# Altium schematic sheet Microcontroller.SchDoc
size A3; SheetNumber: 4; SheetTotal: 5
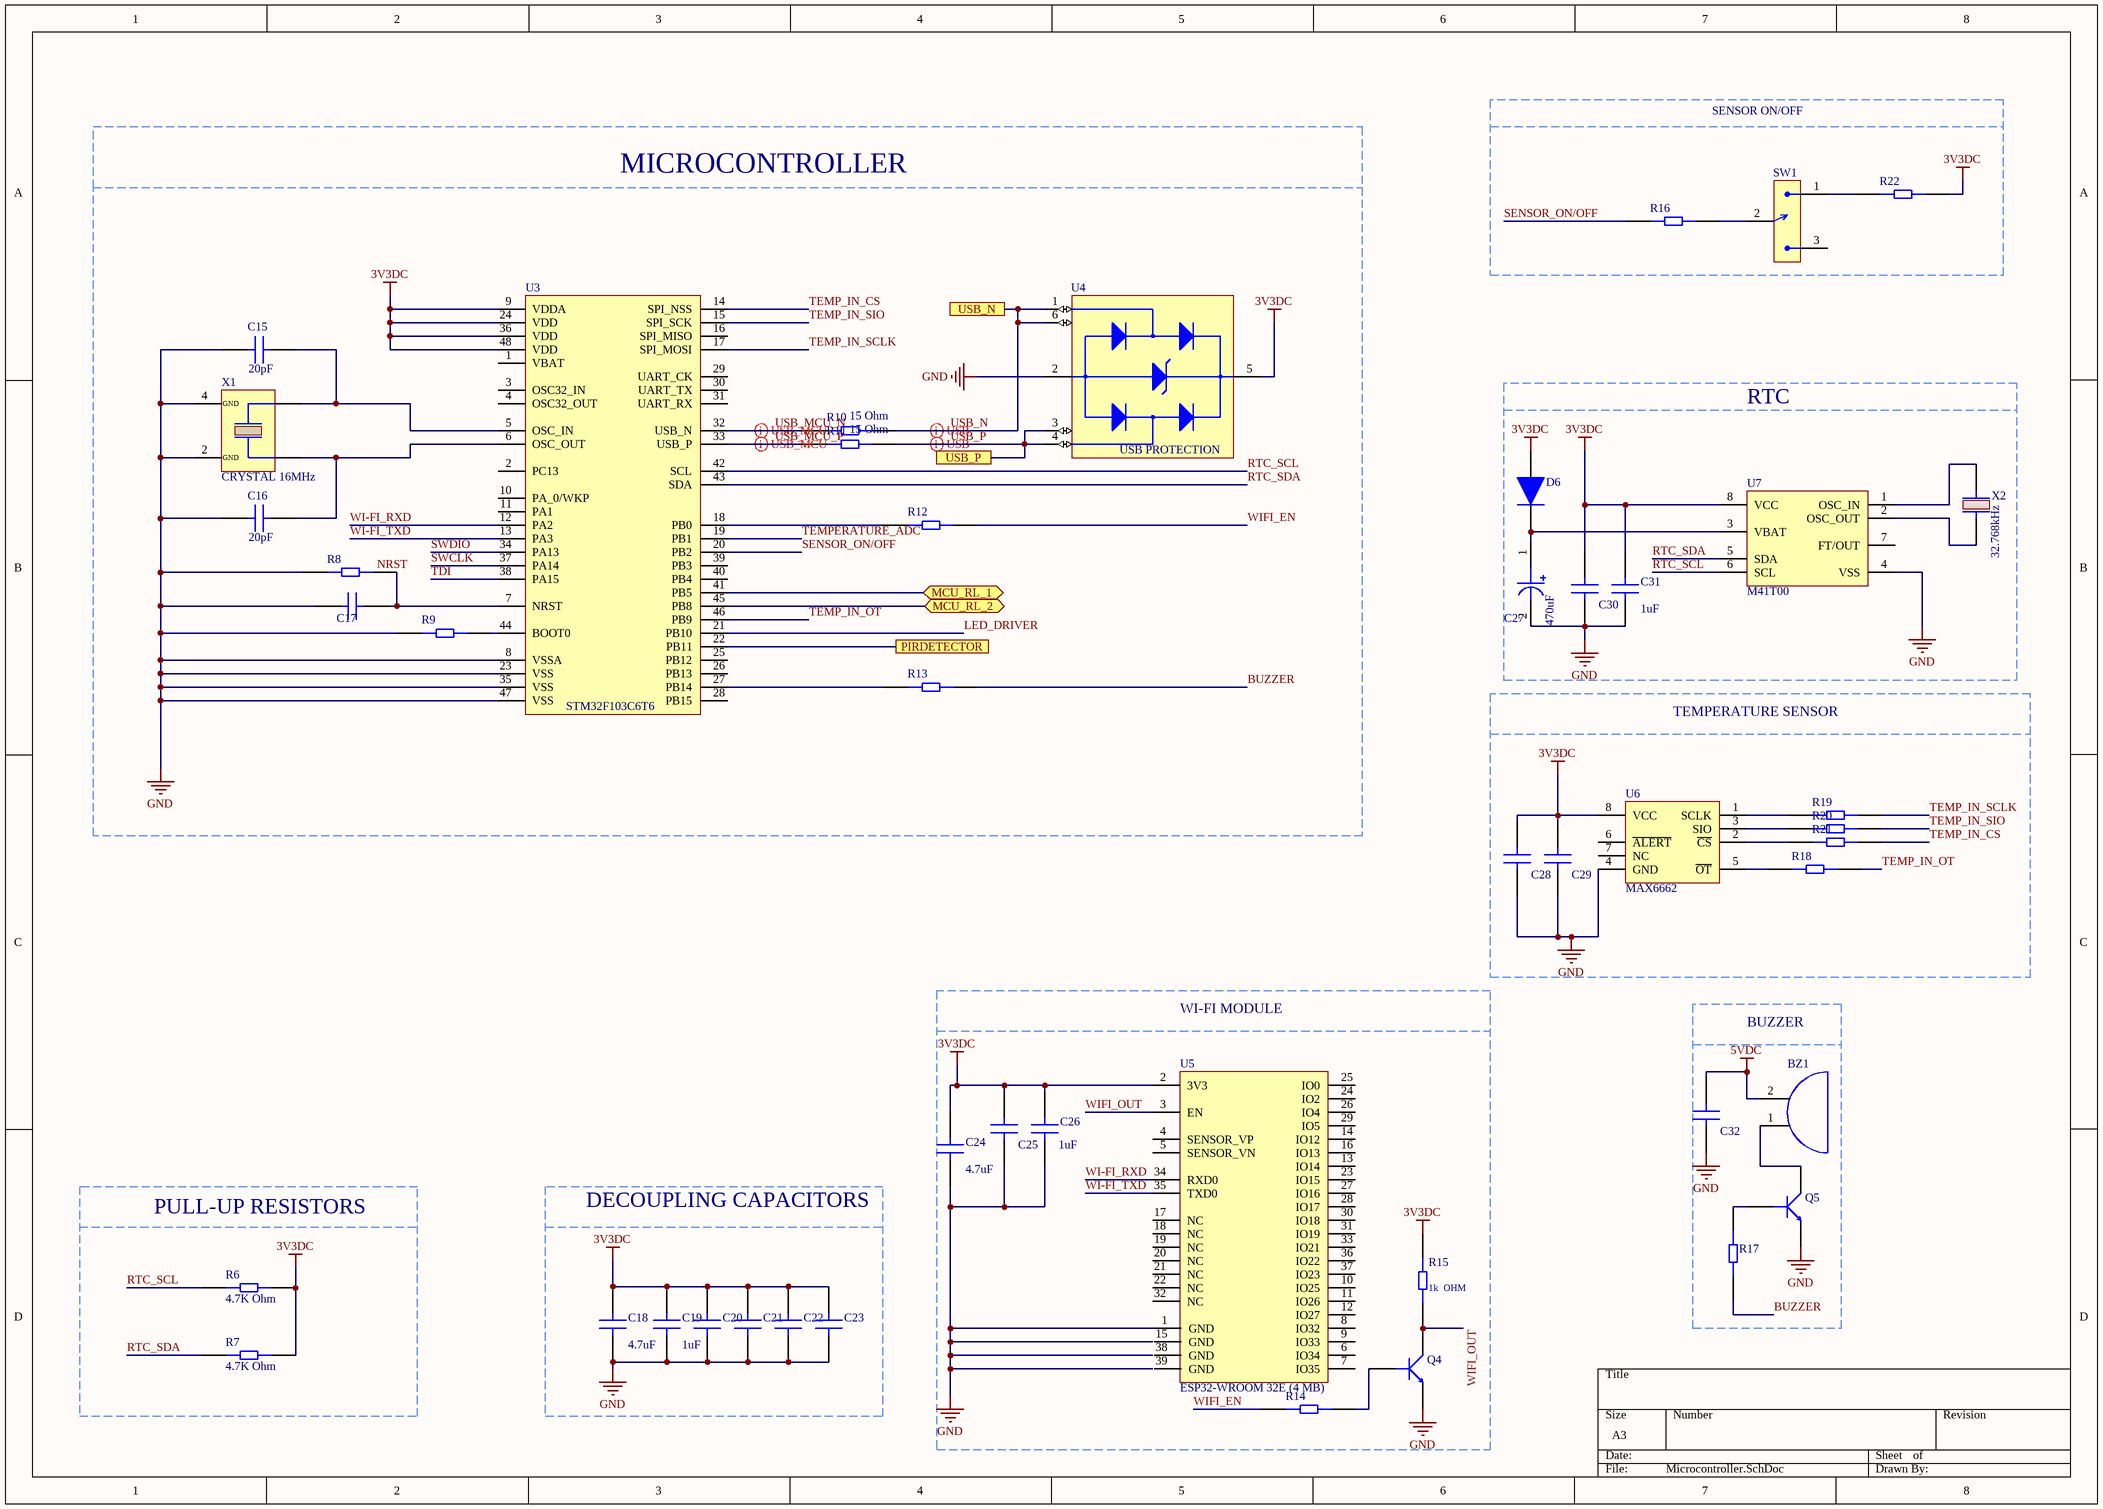
[diagram p0: Microcontroller.SchDoc]

## Parts
BZ1  CMI-9605IC-0580T  [CMI-9605IC]  (value not drawn)
C15  Cap: 20pF  [CAP_0603]  (hidden comment: CAP CER 20pF 0603)
C16  Cap: 20pF  [CAP_0603]  (hidden comment: CAP CER 20pF 0603)
C17  CAP CER 100nF 0603  [CAP_0603]  (value not drawn)
C18  Cap: 4.7uF  [CAP 0805]  (hidden comment: CAP CER 4.7uF 0805)
C19  Cap: 1uF  [CAP 0805]  (hidden comment: CAP CER 1uF)
C20  CAP CER 100nF 0603  [CAP_0603]  (value not drawn)
C21  CAP CER 100nF 0603  [CAP_0603]  (value not drawn)
C22  CAP CER 100nF 0603  [CAP_0603]  (value not drawn)
C23  CAP CER 100nF 0603  [CAP_0603]  (value not drawn)
C24  Cap: 4.7uF  [CAP 0805]  (hidden comment: CAP CER 4.7uF 0805)
C25  CAP CER 100nF 0603  [CAP_0603]  (value not drawn)
C26  Cap: 1uF  [CAP 0805]  (hidden comment: CAP CER 1uF)
C27  Cap: 470uF  [CAP_RADIAL_D10_P5]  (hidden comment: ESH477M050AH4AA)
C28  CAP CER 100nF 0603  [CAP_0603]  (value not drawn)
C29  CAP CER 100nF 0603  [CAP_0603]  (value not drawn)
C30  CAP CER 100nF 0603  [CAP_0603]  (value not drawn)
C31  Cap: 1uF  [CAP 0805]  (hidden comment: CAP CER 1uF)
C32  CAP CER 100nF 0603  [CAP_0603]  (value not drawn)
D6  1N4148WS  [SOD323F]  (value not drawn)
Q4  MMBT3904-7-F  [SOT-23F]  (value not drawn)
Q5  MMBT3904-7-F  [SOT-23F]  (value not drawn)
R6  Resistance: 4.7K Ohm  [RES_0603]  (hidden comment: RES 4.7K OHM 0603)
R7  Resistance: 4.7K Ohm  [RES_0603]  (hidden comment: RES 4.7K OHM 0603)
R8  RES 100 OHM 0603  [RES_0603]  (value not drawn)
R9  RES 100 OHM 0603  [RES_0603]  (value not drawn)
R10  Resistance: 15 Ohm  (hidden comment: RES 15 OHM 0603)
R11  Resistance: 15 Ohm  (hidden comment: RES 15 OHM 0603)
R12  RES 100 OHM 0603  [RES_0603]  (value not drawn)
R13  RES 100 OHM 0603  [RES_0603]  (value not drawn)
R14  RES 100 OHM 0603  [RES_0603]  (value not drawn)
R15  Reisitance: 1k  OHM  [RES_0603]  (hidden comment: RES 1K OHM 0603)
R16  RES 100 OHM 0603  [RES_0603]  (value not drawn)
R17  RES 100 OHM 0603  [RES_0603]  (value not drawn)
R18  RES 100 OHM 0603  [RES_0603]  (value not drawn)
R19  RES 100 OHM 0603  [RES_0603]  (value not drawn)
R20  RES 100 OHM 0603  [RES_0603]  (value not drawn)
R21  RES 100 OHM 0603  [RES_0603]  (value not drawn)
R22  RES 100 OHM 0603  [RES_0603]  (value not drawn)
SW1  EG1215AA  [EG121]  (value not drawn)
U3  STM32F103C6T6  [LQFP-48]
U4  USB PROTECTION  [SOT23-6L]
U5  ESP32-WROOM 32E (4 MB)  [ESP32-32E]
U6  MAX6662  [SOIC8]
U7  M41T00  [SOIC8]
X1  CRYSTAL 16MHz  [ECS]
X2  FREQ: 32.768kHz  [AB505]  (hidden comment: CRYSTAL 32768kHZ)

## Blocks framed on the sheet
SENSOR ON/OFF: R16 R22 SW1
MICROCONTROLLER: C15-C17 R8-R13 U3 U4 X1
RTC: C27 C30 C31 D6 U7 X2
TEMPERATURE SENSOR: C28 C29 R18-R21 U6
WI-FI MODULE: C24-C26 Q4 R14 R15 U5
BUZZER: BZ1 C32 Q5 R17

## Ports
MCU_RL_1 (bidir, see Power Management[288,178]), MCU_RL_2 (bidir, see Power Management[339.076,49.022]), PIRDETECTOR (see Power Management[234.442,99.822]), USB_N (see Power Management[176.84,54]), USB_P (see Power Management[176.784,50.8])

## Nets
3V3DC: C18.2 C19.2 C20.2 C21.2 C22.2 C23.2 C24.2 C25.2 C26.1 C28.2 C29.2 C30.2 C31.1 D6.2 R6.2 R7.2 R15.2 R22.2 U3.9(VDDA) U3.24(VDD) U3.36(VDD) U3.48(VDD) U4.5(VBUS) U5.2(3V3) U6.8(VCC) U7.8(VCC)
5VDC: BZ1.2 C32.2
GND: C15.2 C16.2 C17.2 C18.1 C19.1 C20.1 C21.1 C22.1 C23.1 C24.1 C25.1 C26.2 C27.2 C28.1 C29.1 C30.1 C31.2 C32.1 Q4.2(E) Q5.2(E) R8.1 R9.1 U3.8(VSSA) U3.23(VSS) U3.35(VSS) U3.47(VSS) U4.2(GND) U5.1(GND) U6.4(GND) U7.4(VSS) X1.2(GND) X1.4(GND)
BUZZER: R13.2 R17.1
LED_DRIVER: U3.21(PB10)
MCU_RL_1: U3.41(PB5) ; port MCU_RL_1
MCU_RL_2: U3.45(PB8) ; port MCU_RL_2
PIRDETECTOR: U3.22(PB11) ; port PIRDETECTOR
RTC_SCL: R6.1 U3.42(SCL) U7.6(SCL)
RTC_SDA: R7.1 U3.43(SDA) U7.5(SDA)
SENSOR_ON/OFF: R16.1 U3.20(PB2)
SWCLK: U3.37(PA14)
SWDIO: U3.34(PA13)
TDI: U3.38(PA15)
TEMP_IN_CS: R21.2 U3.14(SPI_NSS)
TEMP_IN_OT: R18.2 U3.46(PB9)
TEMP_IN_SCLK: R19.2 U3.17(SPI_MOSI)
TEMP_IN_SIO: R20.2 U3.15(SPI_SCK)
TEMPERATURE_ADC: U3.19(PB1)
USB_MCU_N: R10.1 U3.32(USB_N)
USB_MCU_P: R11.1 U3.33(USB_P)
USB_N: R10.2 U4.1(I/O1) U4.6(I/O1) ; port USB_N
USB_P: R11.2 U4.3(I/O2) U4.4(I/O2) ; port USB_P
WI-FI_RXD: U3.12(PA2) U5.34(RXD0)
WI-FI_TXD: U3.13(PA3) U5.35(TXD0)
WIFI_EN: R12.2 R14.1
WIFI_OUT: Q4.3(C) R15.1 U5.3(EN)
NetBZ1_1: BZ1.1 Q5.3(C)
NetC15_1: C15.1 U3.5(OSC_IN) X1.3
NetC16_1: C16.1 U3.6(OSC_OUT) X1.1
NetC17_1: C17.1 R8.2 U3.7(NRST)
NetC27_1: C27.1 D6.1 U7.3(VBAT)
NetQ4_1: Q4.1(B) R14.2
NetQ5_1: Q5.1(B) R17.2
NetR9_2: R9.2 U3.44(BOOT0)
NetR12_1: R12.1 U3.18(PB0)
NetR13_1: R13.1 U3.27(PB14)
NetR16_2: R16.2 SW1.2
NetR18_1: R18.1 U6.5(~{OT})
NetR19_1: R19.1 U6.1(SCLK)
NetR20_1: R20.1 U6.3(SIO)
NetR21_1: R21.1 U6.2(~{CS})
NetR22_1: R22.1 SW1.1
NetU7_1: U7.1(OSC_IN) X2.2
NetU7_2: U7.2(OSC_OUT) X2.1

Not connected (* = marked no-connect by the designer): SW1 3; U3 1(VBAT) 2(PC13) 3(OSC32_IN) 4(OSC32_OUT) 10(PA_0/WKP) 11(PA1) 16(SPI_MISO) 25(PB12) 26(PB13) 28(PB15) 29(UART_CK) 30(UART_TX) 31(UART_RX) 39(PB3) 40(PB4); U5 4(SENSOR_VP) 5(SENSOR_VN) 6(IO34) 7(IO35) 8(IO32) 9(IO33) 10(IO25) 11(IO26) 12(IO27) 13(IO14) 14(IO12) 15(GND) 16(IO13) 17(NC) 18(NC) 19(NC) 20(NC) 21(NC) 22(NC) 23(IO15) 24(IO2) 25(IO0) 26(IO4) 27(IO16) 28(IO17) 29(IO5) 30(IO18) 31(IO19) 32(NC) 33(IO21) 36(IO22) 37(IO23) 38(GND) 39(GND); U6 6(~{ALERT}) 7(NC); U7 7(FT/OUT)

## Layout directives
differential pair: USB_MCU_N, USB_MCU_P, USB_N, USB_P

## Notes on the sheet
- PULL-UP RESISTORS
- DECOUPLING CAPACITORS
- Labels drawn without touching a wire or pin: NRST

## Library data of the parts
BZ1 = CMI-9605IC-0580T: Audio Buzzer Magnetic 3VDC 7VDC 30mA 5VDC 85dB 2600Hz to 2800Hz Through Hole Pin Box; Manufacturer: CUI Devices; Supplier 1: Arrow Electronics; Manufacturer Part Number: CMI-9605IC-0580T; RoHS: No; Category: Audio Products; Stock 1: 1; Pricing 1: 1=1.3577, 10=1.146, 25=1.0571, 50=0.9935, 100=0.9263, 300=0.797, 600=0.7855 (USD); Supplier 2: Arrow Electronics; Stock 2: 1; Pricing 2: 1=1.3577, 10=1.146, 25=1.0571, 50=0.9935, 100=0.9263, 300=0.797, 600=0.7855 (USD); Supplier Part Number 2: CMI-9605IC-0580T; Case/Package: CMI-9605IC
C18 C24 = CAP CER 4.7uF 0805: CAP CER 4.7UF 25V X5R 0805; Manufacturer: Samsung; Manufacturer Part Number: CL21A475KAQNNNE; Supplier 1: Arrow Electronics; RoHS: Yes; Category: Ceramic Capacitors; Stock 1: 906000; Pricing 1: 2000=0.0173, 4000=0.0169, 10000=0.0146, 14000=0.0133, 50000=0.0114, 100000=0.0096, 200000=0.0089 (USD); ComponentLink1URL: https://datasheet.ciiva.com/25798/cl21a475kaqnnne-25798882.pdf?src-supplier=Digi-Key; ComponentLink1Description: https://datasheet.ciiva.com/25798/cl21a475kaqnnne-25798882.pdf?src-supplier=Digi-Key; Supplier Part Number 1: CL21A475KAQNNNE
C27 = ESH477M050AH4AA: Cap, 470UF, 50V, Alu Elec, Radial; Manufacturer: KEMET; Supplier 1: Mouser; Manufacturer Part Number: ESH477M050AH4AA; RoHS: Yes; Stock 1: 3823; Pricing 1: 1=0.57, 10=0.4, 50=0.302, 100=0.263, 1000=0.263, 10000=0.263 (USD); ComponentLink1URL: https://api.kemet.com/component-edge/download/datasheet/ESH477M050AH4AA.pdf?src-supplier=Digi-Key; ComponentLink1Description: https://api.kemet.com/component-edge/download/datasheet/ESH477M050AH4AA.pdf?src-supplier=Digi-Key; ComponentLink2URL: https://datasheet.octopart.com/ESH477M050AH4AA-KEMET-datasheet-130075338.pdf?src-supplier=Newark; ComponentLink2Description: https://datasheet.octopart.com/ESH477M050AH4AA-KEMET-datasheet-130075338.pdf?src-supplier=Newark; Supplier Part Number 1: 80-ESH477M050AH4AA
D6 = 1N4148WS: VR=75V IF=150mA Trr=4ns P=200mW; Manufacturer: ON Semiconductor / Fairchild; Supplier 1: Future Electronics; Manufacturer Part Number: 1N4148WS; RoHS: Yes; Category: Rectifier Diodes; Stock 1: 423000; Pricing 1: 3000=0.0191, 12000=0.0183, 45000=0.0175, 75000=0.0173, 150000=0.0164 (USD); ComponentLink1URL: https://datasheet.ciiva.com/30479/0900766b810e1cd3-30479206.pdf?src-supplier=Rs; ComponentLink1Description: https://datasheet.ciiva.com/30479/0900766b810e1cd3-30479206.pdf?src-supplier=Rs; ComponentLink2URL: https://datasheet.ciiva.com/8300/1n914bws-8300360.pdf?src-supplier=Avnet; ComponentLink2Description: https://datasheet.ciiva.com/8300/1n914bws-8300360.pdf?src-supplier=Avnet; ComponentLink3URL: https://datasheet.ciiva.com/15208/getdatasheetpartid-127819-15208358.pdf?src-supplier=Verical; ComponentLink3Description: https://datasheet.ciiva.com/15208/getdatasheetpartid-127819-15208358.pdf?src-supplier=Verical; ComponentLink4URL: https://datasheet.ciiva.com/910/1n4148ws-910380.pdf?src-supplier=Digi-Key; ComponentLink4Description: https://datasheet.ciiva.com/910/1n4148ws-910380.pdf?src-supplier=Digi-Key; ComponentLink5URL: https://datasheet.ciiva.com/910/1n4148ws-910381.pdf?src-supplier=Digi-Key; ComponentLink5Description: https://datasheet.ciiva.com/910/1n4148ws-910381.pdf?src-supplier=Digi-Key; ComponentLink6URL: https://datasheet.ciiva.com/910/1n4148ws-910382.pdf?src-supplier=Digi-Key; ComponentLink6Description: https://datasheet.ciiva.com/910/1n4148ws-910382.pdf?src-supplier=Digi-Key; Supplier Part Number 1: 8814485
SW1 = EG1215AA: Slide Switch, SPDT, 0.025A, 24V, SMD; Manufacturer: E-Switch; Mechanical Life: 10000Cycles; Switch Function: On-On; Actuator Type: Standard; Switch Travel: 1.5mm; Operating Force: 150gf; Actuator Length: 1.4mm; Supplier 1: Farnell; Manufacturer Part Number: EG1215AA; RoHS: Yes; Stock 1: 2239; Pricing 1: 1=1.06, 10=0.958, 25=0.831, 50=0.777, 100=0.722 (EUR); Mount: Surface Mount; Min Operating Temperature: -20°C; Max Operating Temperature: 70°C; Throw Configuration: SPDT; Packaging: Cut Tape; Voltage Rating (DC): 24V; Termination: Gull Wing; Electrical Life: 10000Cycles; Series: EG; RoHS Compliant: Yes; ComponentLink1URL: https://media.digikey.com/pdf/Data%20Sheets/E-Switch%20PDFs/EG1215_Series_Ds.pdf?src-supplier=Digi-Key; ComponentLink1Description: https://media.digikey.com/pdf/Data%20Sheets/E-Switch%20PDFs/EG1215_Series_Ds.pdf?src-supplier=Digi-Key; ComponentLink2URL: http://www.farnell.com/datasheets/2645007.pdf?src-supplier=Farnell; ComponentLink2Description: http://www.farnell.com/datasheets/2645007.pdf?src-supplier=Farnell; Supplier Part Number 1: 4050996
U4 = USB PROTECTION: TVS DIODE 5.25VWM 17VC SOT23-6; Manufacturer: STMicroelectronics; Manufacturer Part Number: USBLC6-2SC6; Supplier 1: Mouser; RoHS: Yes; Category: TVS Diodes; Stock 1: 229222; Pricing 1: 1=0.59, 10=0.507, 50=0.507, 100=0.379, 1000=0.23, 10000=0.182 (USD); ComponentLink1URL: https://datasheet.ciiva.com/15143/getdatasheetpartid-148465-15143789.pdf?src-supplier=Verical; ComponentLink1Description: https://datasheet.ciiva.com/15143/getdatasheetpartid-148465-15143789.pdf?src-supplier=Verical; ComponentLink2URL: https://datasheet.ciiva.com/4508/cd00050750-113117-4508433.pdf?src-supplier=Mouser; ComponentLink2Description: https://datasheet.ciiva.com/4508/cd00050750-113117-4508433.pdf?src-supplier=Mouser; ComponentLink3URL: https://datasheet.ciiva.com/1268/1690354-1268384.pdf?src-supplier=Element14; ComponentLink3Description: https://datasheet.ciiva.com/1268/1690354-1268384.pdf?src-supplier=Element14; ComponentLink4URL: https://datasheet.ciiva.com/16200/cd00050750-16200026.pdf?src-supplier=Future+Electronics; ComponentLink4Description: https://datasheet.ciiva.com/16200/cd00050750-16200026.pdf?src-supplier=Future+Electronics; ComponentLink5URL: https://datasheet.ciiva.com/41444/001184109-da-01-en-ic-esd-protecti-usblc6-2sc6-sot-23-6-stm-41444156.pdf?src-supplier=Conrad; ComponentLink5Description: https://datasheet.ciiva.com/41444/001184109-da-01-en-ic-esd-protecti-usblc6-2sc6-sot-23-6-stm-41444156.pdf?src-supplier=Conrad; Supplier Part Number 1: 511-USBLC6-2SC6
U6 = MAX6662: Temp Sensor Digital Serial (3-Wire, SPI) 8-Pin SOIC N Tube; Manufacturer: Maxim; Manufacturer Part Number: MAX6662MSA+; Supplier 1: Mouser; RoHS: Yes; Category: Temperature and Humidity Sensors; Stock 1: 1124; Pricing 1: 1=2.45, 10=2.35, 50=2.35, 100=2.34, 1000=2.2, 10000=1.95 (USD); ComponentLink1URL: https://datasheet.ciiva.com/5299/max6662-89142-5299456.pdf?src-supplier=Mouser; ComponentLink1Description: https://datasheet.ciiva.com/5299/max6662-89142-5299456.pdf?src-supplier=Mouser; ComponentLink2URL: https://datasheet.ciiva.com/3277/max6662-3277979.pdf?src-supplier=Avnet; ComponentLink2Description: https://datasheet.ciiva.com/3277/max6662-3277979.pdf?src-supplier=Avnet; ComponentLink3URL: https://datasheet.ciiva.com/2003/max6662-2003390.pdf?src-supplier=Digi-Key; ComponentLink3Description: https://datasheet.ciiva.com/2003/max6662-2003390.pdf?src-supplier=Digi-Key; Supplier Part Number 1: 700-MAX6662MSA
U7 = M41T00: Real-time Clocks Clock/Calendar I2C, 2-Wire Serial 70uA @ 2V ~ 5.5V SOIC-8_150mil RoHS; Manufacturer: STMicroelectronics; Manufacturer Part Number: M41T00M6F; Supplier 1: Digi-Key; RoHS: Yes; Category: Real Time Clocks; Stock 1: 5505; Pricing 1: 1=3.96, 10=3.556, 25=3.3616, 100=2.9134, 250=2.76404, 500=2.48016, 1000=2.11425 (USD); ComponentLink1URL: https://datasheet.ciiva.com/7630/1837112-7630077.pdf?src-supplier=Element14; ComponentLink1Description: https://datasheet.ciiva.com/7630/1837112-7630077.pdf?src-supplier=Element14; ComponentLink2URL: https://datasheet.ciiva.com/16213/cd00001542-16213654.pdf?src-supplier=Future+Electronics; ComponentLink2Description: https://datasheet.ciiva.com/16213/cd00001542-16213654.pdf?src-supplier=Future+Electronics; ComponentLink3URL: https://datasheet.ciiva.com/41459/001185345-da-01-en-ic-rtc-srl-512kbit-m41t00m6f-soic-8-stm-41459818.pdf?src-supplier=Conrad; ComponentLink3Description: https://datasheet.ciiva.com/41459/001185345-da-01-en-ic-rtc-srl-512kbit-m41t00m6f-soic-8-stm-41459818.pdf?src-supplier=Conrad; Supplier Part Number 1: 497-4697-1-ND
X1 = CRYSTAL 16MHz: Crystal 16MHz ±30ppm (Tol) ±50ppm (Stability) 20pF FUND 50Ohm 4-Pin Mini-SMD T/R; Manufacturer: Abracon; Manufacturer Part Number: ABS05-32.768KHZ-T; Supplier 1: Future Electronics; RoHS: Yes; Category: Crystals; Stock 1: 2890; Pricing 1: 1=0.85, 15=0.75, 75=0.69, 300=0.64, 1500=0.58 (USD); ComponentLink1URL: https://datasheet.ciiva.com/23810/abs05-23810480.pdf?src-supplier=Newark; ComponentLink1Description: https://datasheet.ciiva.com/23810/abs05-23810480.pdf?src-supplier=Newark; ComponentLink2URL: https://datasheet.ciiva.com/6728/abs05-6728949.pdf?src-supplier=Digi-Key; ComponentLink2Description: https://datasheet.ciiva.com/6728/abs05-6728949.pdf?src-supplier=Digi-Key; ComponentLink3URL: https://datasheet.ciiva.com/6728/abs05-6728950.pdf?src-supplier=Digi-Key; ComponentLink3Description: https://datasheet.ciiva.com/6728/abs05-6728950.pdf?src-supplier=Digi-Key; ComponentLink4URL: https://datasheet.ciiva.com/16411/abs05-16411149.pdf?src-supplier=Future+Electronics; ComponentLink4Description: https://datasheet.ciiva.com/16411/abs05-16411149.pdf?src-supplier=Future+Electronics; Supplier Part Number 1: 4097386; Supplier 2: Arrow Electronics; Stock 2: 17; Pricing 2: 1=0.8053, 10=0.7919 (USD); ComponentLink5URL: https://datasheet.ciiva.com/853/ecx-53b-853408.pdf?src-supplier=Digi-Key; ComponentLink5Description: https://datasheet.ciiva.com/853/ecx-53b-853408.pdf?src-supplier=Digi-Key; ComponentLink6URL: https://datasheet.ciiva.com/853/ecx-53b-853407.pdf?src-supplier=Digi-Key; ComponentLink6Description: https://datasheet.ciiva.com/853/ecx-53b-853407.pdf?src-supplier=Digi-Key; ComponentLink7URL: https://datasheet.ciiva.com/853/ecx-53b-853406.pdf?src-supplier=Digi-Key; ComponentLink7Description: https://datasheet.ciiva.com/853/ecx-53b-853406.pdf?src-supplier=Digi-Key; Supplier Part Number 2: ECS-160-20-30B-TR
X2 = CRYSTAL 32768kHZ: Crystal 0.032768MHz ±20ppm (Tol) 12.5pF Flexural 90000Ohm 2-Pin CSMD T/R; Manufacturer: Abracon; Manufacturer Part Number: ABS05-32.768KHZ-T; Supplier 1: Future Electronics; RoHS: Yes; Category: Crystals; Stock 1: 2890; Pricing 1: 1=0.85, 15=0.75, 75=0.69, 300=0.64, 1500=0.58 (USD); ComponentLink1URL: https://datasheet.ciiva.com/23810/abs05-23810480.pdf?src-supplier=Newark; ComponentLink1Description: https://datasheet.ciiva.com/23810/abs05-23810480.pdf?src-supplier=Newark; ComponentLink2URL: https://datasheet.ciiva.com/6728/abs05-6728949.pdf?src-supplier=Digi-Key; ComponentLink2Description: https://datasheet.ciiva.com/6728/abs05-6728949.pdf?src-supplier=Digi-Key; ComponentLink3URL: https://datasheet.ciiva.com/6728/abs05-6728950.pdf?src-supplier=Digi-Key; ComponentLink3Description: https://datasheet.ciiva.com/6728/abs05-6728950.pdf?src-supplier=Digi-Key; ComponentLink4URL: https://datasheet.ciiva.com/16411/abs05-16411149.pdf?src-supplier=Future+Electronics; ComponentLink4Description: https://datasheet.ciiva.com/16411/abs05-16411149.pdf?src-supplier=Future+Electronics; Supplier Part Number 1: 4097386
C17 C20-C23 C25 C28-C30 C32 = CAP CER 100nF 0603: Case/Package: 0603